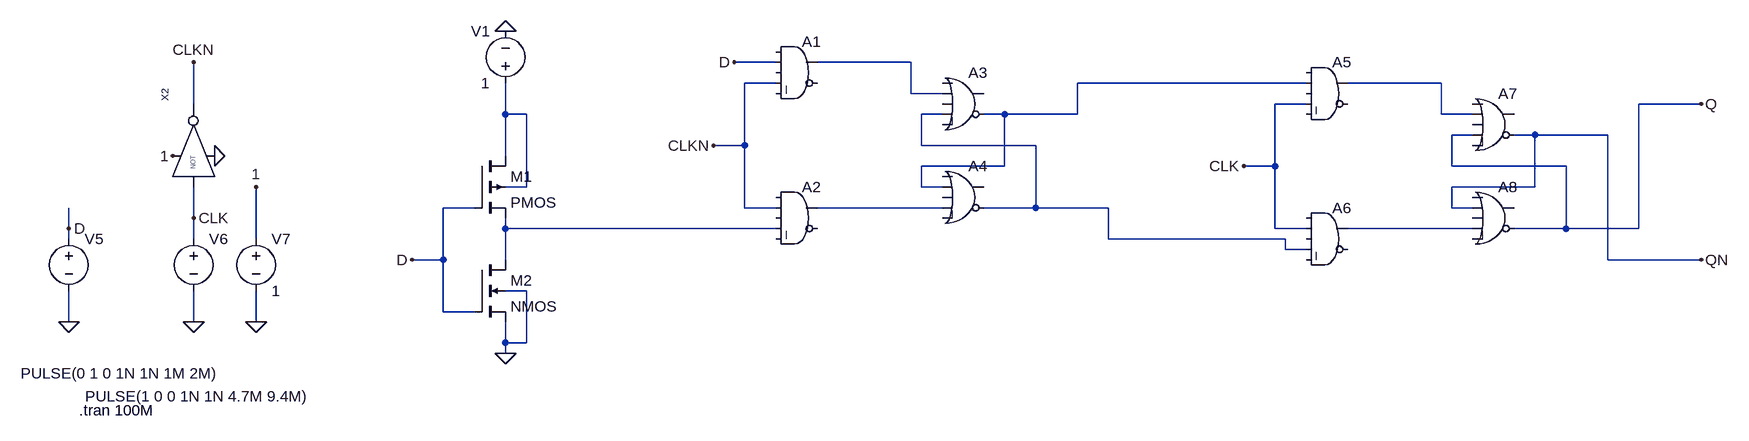
[diagram p0: schematic Draft39.asc]
Draft39.asc, the LTspice schematic file:
Version 4
SHEET 1 1540 680
WIRE 64 0 0 0
WIRE 272 0 128 0
WIRE 64 32 16 32
WIRE 880 32 528 32
WIRE 1088 32 944 32
WIRE 272 48 272 0
WIRE 320 48 272 48
WIRE -832 64 -832 0
WIRE 880 64 832 64
WIRE 1488 64 1392 64
WIRE -352 80 -352 32
WIRE -320 80 -352 80
WIRE 320 80 288 80
WIRE 416 80 384 80
WIRE 528 80 528 32
WIRE 528 80 416 80
WIRE 1088 80 1088 32
WIRE 1136 80 1088 80
WIRE 1136 112 1104 112
WIRE 1232 112 1200 112
WIRE 1344 112 1232 112
WIRE 16 128 16 32
WIRE 16 128 -32 128
WIRE 288 128 288 80
WIRE 464 128 288 128
WIRE -352 144 -352 80
WIRE 416 160 416 80
WIRE 416 160 288 160
WIRE 832 160 832 64
WIRE 832 160 784 160
WIRE 1104 160 1104 112
WIRE 1280 160 1104 160
WIRE -320 192 -320 80
WIRE -320 192 -352 192
WIRE 288 192 288 160
WIRE 320 192 288 192
WIRE 1232 192 1232 112
WIRE 1232 192 1104 192
WIRE -400 224 -448 224
WIRE 16 224 16 128
WIRE 64 224 16 224
WIRE 320 224 128 224
WIRE 464 224 464 128
WIRE 464 224 384 224
WIRE 576 224 464 224
WIRE 1104 224 1104 192
WIRE 1136 224 1104 224
WIRE -832 240 -832 192
WIRE -1024 256 -1024 224
WIRE -352 256 -352 240
WIRE 64 256 -352 256
WIRE 832 256 832 160
WIRE 880 256 832 256
WIRE 1136 256 944 256
WIRE 1280 256 1280 160
WIRE 1280 256 1200 256
WIRE 1392 256 1392 64
WIRE 1392 256 1280 256
WIRE -1024 272 -1024 256
WIRE -832 272 -832 240
WIRE -736 272 -736 192
WIRE 576 272 576 224
WIRE 848 272 576 272
WIRE 848 288 848 272
WIRE 880 288 848 288
WIRE -448 304 -448 224
WIRE -448 304 -496 304
WIRE -352 304 -352 256
WIRE 1344 304 1344 112
WIRE 1488 304 1344 304
WIRE -320 352 -352 352
WIRE -448 384 -448 304
WIRE -400 384 -448 384
WIRE -1024 400 -1024 352
WIRE -832 400 -832 352
WIRE -736 400 -736 352
WIRE -352 432 -352 400
WIRE -320 432 -320 352
WIRE -320 432 -352 432
WIRE -352 448 -352 432
FLAG -32 128 CLKN
FLAG 0 0 D
FLAG -352 -48 0
FLAG -352 448 0
FLAG -496 304 D
FLAG 784 160 CLK
FLAG 1488 304 QN
FLAG 1488 64 Q
FLAG -1024 400 0
FLAG -832 400 0
FLAG -736 192 1
FLAG -1024 256 D
FLAG -832 0 CLKN
FLAG -736 400 0
FLAG -864 144 1
FLAG -800 144 0
FLAG -832 240 CLK
SYMBOL Digital\\and 96 -48 R0
SYMATTR InstName A1
SYMBOL Digital\\and 96 176 R0
SYMATTR InstName A2
SYMBOL Digital\\or 352 0 R0
SYMATTR InstName A3
SYMBOL Digital\\or 352 144 R0
SYMATTR InstName A4
SYMBOL pmos4 -400 144 R0
SYMATTR InstName M1
SYMBOL nmos4 -400 304 R0
SYMATTR InstName M2
SYMBOL voltage -352 48 R180
WINDOW 0 24 96 Left 2
WINDOW 3 24 16 Left 2
WINDOW 123 0 0 Left 0
WINDOW 39 0 0 Left 0
SYMATTR InstName V1
SYMATTR Value 1
SYMBOL Digital\\and 912 -16 R0
SYMATTR InstName A5
SYMBOL Digital\\and 912 208 R0
SYMATTR InstName A6
SYMBOL Digital\\or 1168 32 R0
SYMATTR InstName A7
SYMBOL Digital\\or 1168 176 R0
SYMATTR InstName A8
SYMBOL voltage -1024 256 R0
WINDOW 3 -74 223 Left 2
WINDOW 123 0 0 Left 0
WINDOW 39 0 0 Left 0
SYMATTR Value PULSE(0 1 0 1N 1N 1M 2M)
SYMATTR InstName V5
SYMBOL voltage -832 256 R0
WINDOW 3 -167 258 Left 2
WINDOW 123 0 0 Left 0
WINDOW 39 0 0 Left 0
SYMATTR Value PULSE(1 0 0 1N 1N 4.7M 9.4M)
SYMATTR InstName V6
SYMBOL voltage -736 256 R0
WINDOW 123 0 0 Left 0
WINDOW 39 0 0 Left 0
SYMATTR InstName V7
SYMATTR Value 1
SYMBOL NOT4 -816 128 R270
SYMATTR InstName X2
TEXT -1008 536 Left 2 !.tran 100M

The netlist it stands for:
* Draft39.asc
A1 0 D 0 CLKN 0 0 N001 0 AND
A2 0 CLKN 0 N007 0 0 N006 0 AND
A3 0 N001 0 N005 0 N002 0 0 OR
A4 0 N002 0 N006 0 N005 0 0 OR
M1 N004 D N007 N004 PMOS
M2 N007 D 0 0 NMOS
V1 N004 0 1
A5 0 N002 0 CLK 0 0 N003 0 AND
A6 0 CLK 0 N005 0 0 N008 0 AND
A7 0 N003 0 Q 0 QN 0 0 OR
A8 0 QN 0 N008 0 Q 0 0 OR
V5 D 0 PULSE(0 1 0 1N 1N 1M 2M)
V6 CLK 0 PULSE(1 0 0 1N 1N 4.7M 9.4M)
V7 1 0 1
XX2 CLK 1 0 CLKN NOT4  ; pins A VH VL OUT
.model NMOS NMOS
.model PMOS PMOS
.lib standard.mos
.tran 100M
.backanno
.end

* Results of the author's LTspice run, read from the files saved beside the schematic
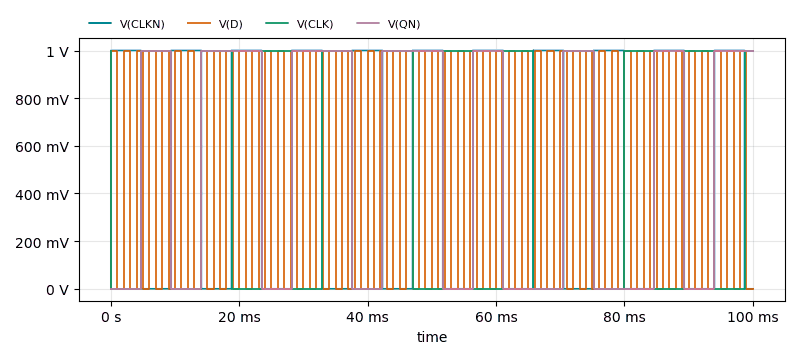
[diagram p1: Transient Analysis of Draft39.asc, plotted from the saved traces]
* Transient Analysis, 1 run:
*   V(CLKN): min 0 V, max 1.001 V, average 517 mV, rms 719 mV, last 100.5 nV
*   V(D): min 0 V, max 1 V, average 500 mV, rms 707.1 mV, last 0 V
*   V(CLK): min 0 V, max 1 V, average 483 mV, rms 695 mV, last 1 V
*   V(QN): min 0 V, max 1 V, average 530 mV, rms 728 mV, last 1 V